# Altium project Bluetooth_Sentinel.PrjPcb
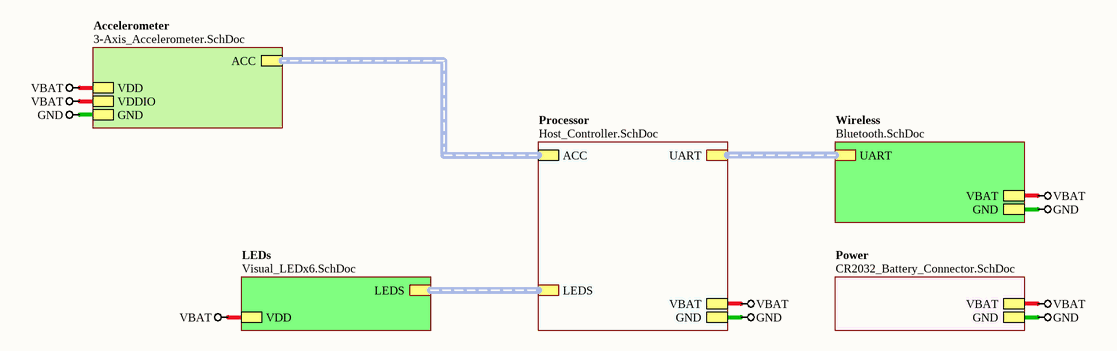
[diagram p0: Bluetooth_Sentinel.SchDoc]
2 sheets, 1 parts. Net scope: hierarchical (ports join the sheet entries above them; power ports are global).
Board file: Bluetooth_Sentinel.PcbDoc
Sheets:
  Bluetooth_Sentinel.SchDoc
    Processor = Host_Controller.SchDoc

## Sheet Bluetooth_Sentinel.SchDoc: Bluetooth Sentinel
size A4

### Sub-sheets
Accelerometer = 3-Axis_Accelerometer.SchDoc (file not in this document): VDD, VDDIO, GND, ACC (harness SPI_LIS331)
LEDs = Visual_LEDx6.SchDoc (file not in this document): VDD, LEDS (harness LEDx6)
Power = CR2032_Battery_Connector.SchDoc (file not in this document): VBAT, GND
Processor = Host_Controller.SchDoc: UART (harness UART_HS), LEDS (harness LEDx6), VBAT, GND, ACC (harness SPI_LIS331)
Wireless = Bluetooth.SchDoc (file not in this document): UART (harness UART_HS), VBAT, GND

### Nets
GND: sheet Power/GND, sheet Wireless/GND, sheet Processor/GND, sheet Accelerometer/GND
VBAT: sheet Power/VBAT, sheet LEDs/VDD, sheet Wireless/VBAT, sheet Processor/VBAT, sheet Accelerometer/VDD, sheet Accelerometer/VDDIO

### Buses and harness runs
harness sheet Accelerometer/ACC = sheet Processor/ACC
harness sheet LEDs/LEDS = sheet Processor/LEDS
harness sheet Processor/UART = sheet Wireless/UART

### Notes on the sheet
- Sheet Title
- Project Title
- Size:
- Date:
- A4
- Item:
- Time:
- Revision:
- Sheet
- of
- File:

## Sheet Host_Controller.SchDoc: Host Controller
size A4
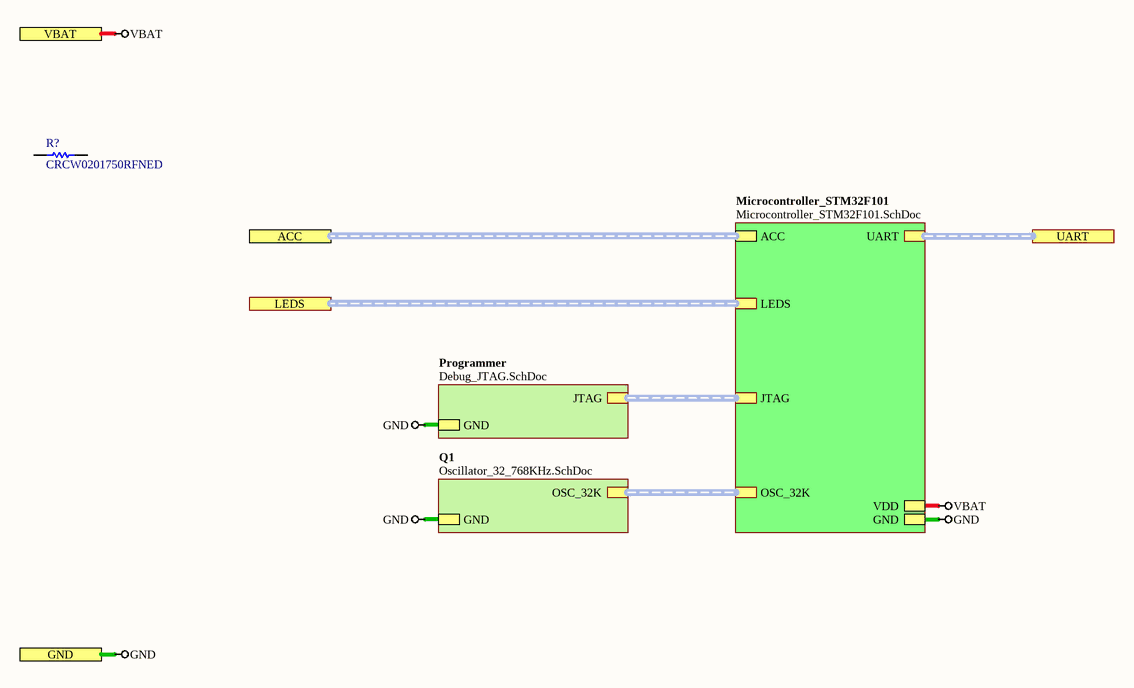
[diagram p1: Host_Controller.SchDoc]

### Parts
R?  CRCW0201750RFNED  [RESC0603X28X15ML05T05]

### Sub-sheets
Microcontroller_STM32F101 = Microcontroller_STM32F101.SchDoc (file not in this document): JTAG (harness JTAG), GND, VDD, UART (harness UART_HS), OSC_32K (harness OSC), LEDS (harness LEDx6), ACC (harness SPI_LIS331)
Programmer = Debug_JTAG.SchDoc (file not in this document): JTAG (harness JTAG), GND
Q1 = Oscillator_32_768KHz.SchDoc (file not in this document): GND, OSC_32K (harness OSC)

### Ports
ACC (harness SPI_LIS331), GND, LEDS (harness LEDx6), UART (harness UART_HS), VBAT

### Nets
GND: port GND, sheet Programmer/GND, sheet Microcontroller_STM32F101/GND, sheet Q1/GND
VBAT: port VBAT, sheet Microcontroller_STM32F101/VDD

Not connected (* = marked no-connect by the designer): R? 1 2

### Buses and harness runs
harness port ACC = sheet Microcontroller_STM32F101/ACC
harness port LEDS = sheet Microcontroller_STM32F101/LEDS
harness port UART = sheet Microcontroller_STM32F101/UART
harness sheet Microcontroller_STM32F101/JTAG = sheet Programmer/JTAG
harness sheet Microcontroller_STM32F101/OSC_32K = sheet Q1/OSC_32K

### Notes on the sheet
- Sheet Title
- Project Title
- Size:
- Date:
- A4
- Item:
- Time:
- Revision:
- Sheet
- of
- File:

### Library data of the parts
R? = CMP-00000-A.1: Fixed Resistor, Metal Glaze/thick Film, 0.05W, 750ohm, 30V, 1% +/-Tol, 200ppm/Cel, Surface Mount, 0201